# Altium schematic sheet SD Card Interface.SchDoc: RB25DET - SD Card Interface
size A4; Address1: Drawn By:; Address2: Dan Visser; DocumentNumber: A; Revision: 0.1; SheetNumber: 11; SheetTotal: 12
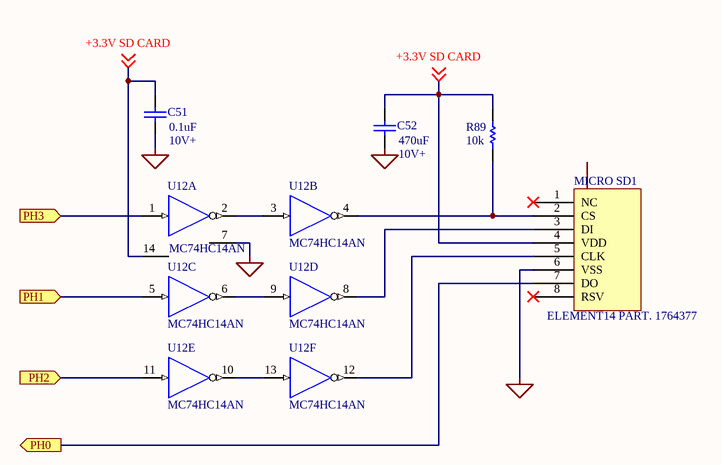
[diagram p0: SD Card Interface.SchDoc]

## Parts
C51  value 0.1uF  [RAD-0.3]
C52  value 470uF  [RAD-0.3]
MICRO_SD1  ELEMENT14 PART. 1764377
R89  value 10k  [AXIAL-0.3]
U12  MC74HC14AN  [646-06]  (parts A,B,C,D,E,F of 6)

## Ports
PH0 (out), PH1 (in), PH2 (in), PH3 (in)

## Nets
GND: U12.7(GND)
NetC51_1: C51.1 C52.1 MICRO_SD1.6(VSS) U12.7(GND)
VDD: U12.14(VDD)
+3.3V SD CARD: C51.2 C52.2 MICRO_SD1.4(VDD) R89.2 U12.14(VDD) ; off-sheet +3.3V SD CARD
PH0: MICRO_SD1.7(DO) ; port PH0
PH1: U12.5(A) ; port PH1
PH2: U12.11(A) ; port PH2
PH3: U12.1(A) ; port PH3
NetMICRO_SD1_2: MICRO_SD1.2(CS) R89.1 U12.4(Y)
NetMICRO_SD1_3: MICRO_SD1.3(DI) U12.8(Y)
NetMICRO_SD1_5: MICRO_SD1.5(CLK) U12.12(Y)
NetU12_2: U12.2(Y) U12.3(A)
NetU12_6: U12.6(Y) U12.9(A)
NetU12_10: U12.10(Y) U12.13(A)

Not connected (* = marked no-connect by the designer): MICRO_SD1 1(NC)* 8(RSV)*

## Notes on the sheet
- (near C51) 10V+
- (near C52) 10V+
- Title
- Size:
- Date:
- A4
- Number:
- Time:
- Revision:
- Sheet
- of

## Library data of the parts
C51 C52 = Cap: Capacitor; Published: 8-Jun-2000; LatestRevisionDate: 17-Jul-2002; LatestRevisionNote: Re-released for DXP Platform.; PackageReference: RAD-0.3; Publisher: Altium Limited; PackageDescription: Radial Cap, Thru-Hole; 2 Leads; 0.3 in Pin Spacing
R89 = Res1: Resistor; Published: 8-Jun-2000; LatestRevisionDate: 17-Jul-2002; LatestRevisionNote: Re-released for DXP Platform.; PackageReference: AXIAL-0.3; Publisher: Altium Limited; PackageDescription: Axial Device, Thru-Hole; 2 Leads; 0.3 in Pin Spacing
U12 = MC74HC14AN: Hex Schmitt Trigger Inverter; Published: 17-Jul-2002; LatestRevisionDate: 06-Jun-2005; LatestRevisionNote: Stylized 3D Model Added; DatasheetVersion: 1989; PackageVersion: 1997; PackageReference: 646-06; Publisher: Altium Limited; PackageDescription: DIP; 14 Leads; Row Spacing 7.62 mm; Pitch 2.54 mm; ComponentLink1Description: Manufacturer Link; ComponentLink1URL: http://www.onsemi.com/site/products/parametrics/0,4446,247,00.html; ComponentLink2Description: Ibis Model; ComponentLink2URL: http://www.onsemi.com/pub/Collateral/MC54HC14AJ.IBS